# Altium project Flight_Controller.PrjPcb
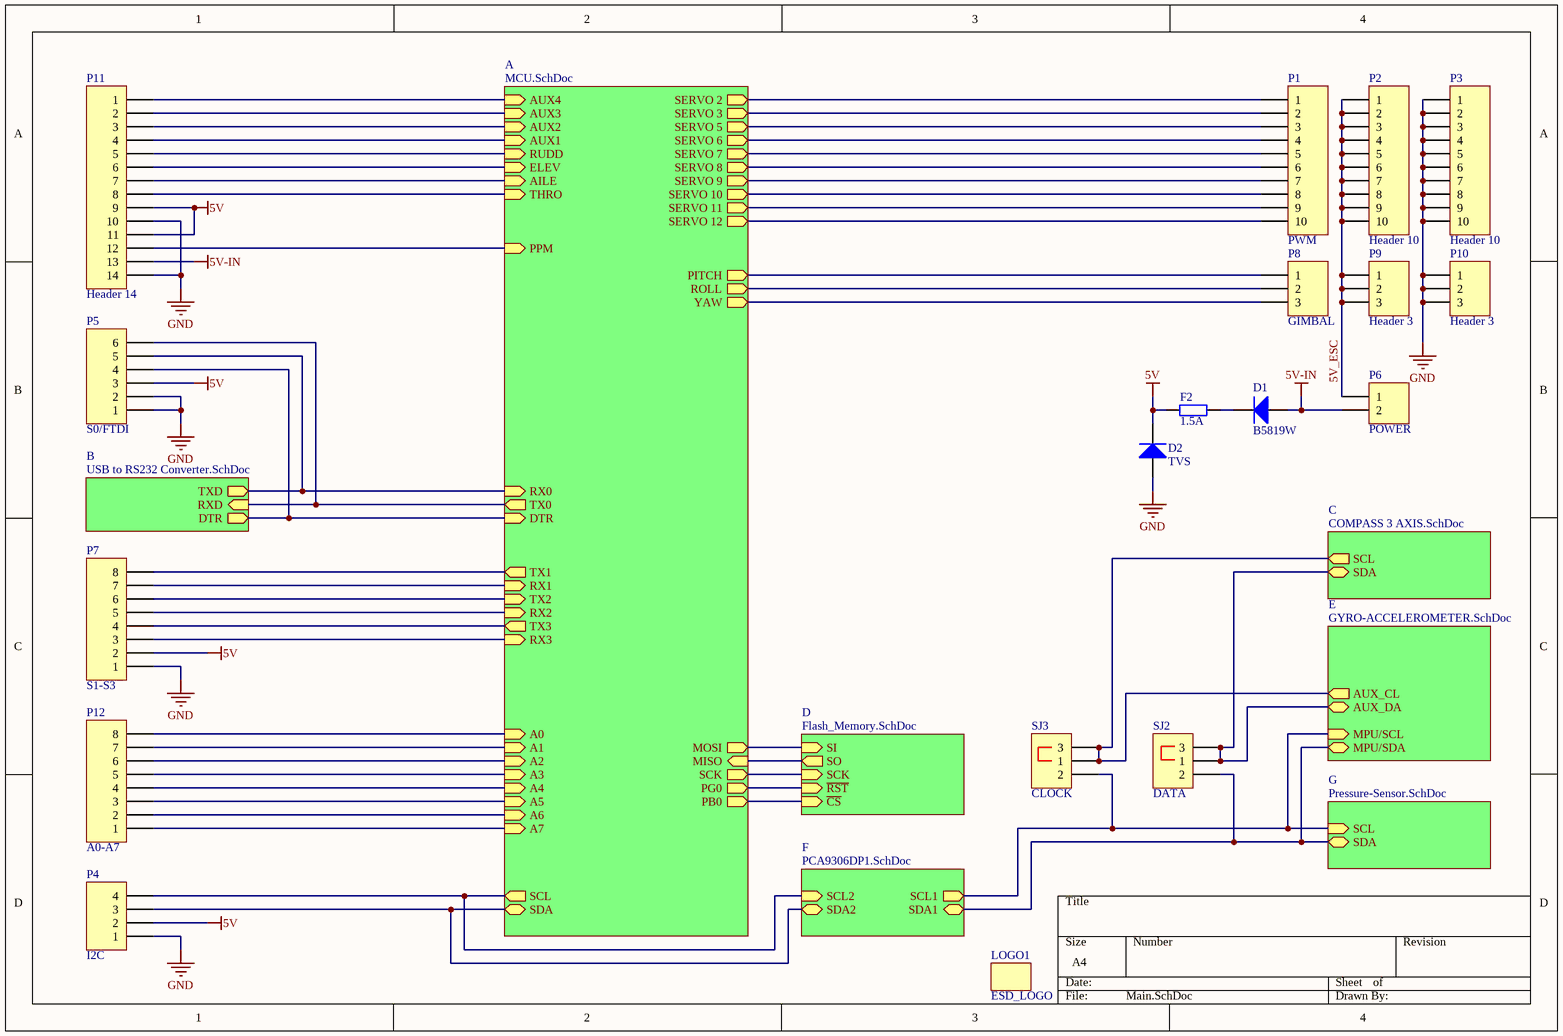
[diagram p0: Main.SchDoc]
8 sheets, 102 parts. Net scope: hierarchical (ports join the sheet entries above them; power ports are global).
Board file: Flight_Controller.PcbDoc
Sheets:
  Main.SchDoc
    A = MCU.SchDoc
    C = COMPASS 3 AXIS.SchDoc
    D = Flash_Memory.SchDoc
    E = GYRO-ACCELEROMETER.SchDoc
    F = PCA9306DP1.SchDoc
    G = Pressure-Sensor.SchDoc
    B = USB to RS232 Converter.SchDoc

## Sheet Main.SchDoc
size A4

### Parts
D1  B5819W  [SOD-123]
D2  TVS  [SOD-123]
F2  1.5A  [FUSE_1206(3216)]
LOGO1  ESD_LOGO  [LOGO_ESD]  (no BOM)
P1  PWM  [Pin Header 1x10 TH Pitch 2.54mm]
P2  Header 10  [Pin Header 1x10 TH Pitch 2.54mm]
P3  Header 10  [Pin Header 1x10 TH Pitch 2.54mm]
P4  I2C  [MOLEX-CONN-PicoBlade 4POS 1.25MM]
P5  S0/FTDI  [MOLEX-CONN-PicoBlade 6POS 1.25MM]
P6  POWER  [Pin Header S/M 02x1 TH Pitch 2.54mm]
P7  S1-S3  [MOLEX-CONN-PicoBlade 8POS 1.25MM]
P8  GIMBAL  [Pin Header 1x3 TH Pitch 2.54mm]
P9  Header 3  [Pin Header 1x3 TH Pitch 2.54mm]
P10  Header 3  [Pin Header 1x3 TH Pitch 2.54mm]
P11  Header 14  [Pin Header 1x14 TH Pitch 2.54mm]
P12  A0-A7  [MOLEX-CONN-PicoBlade 8POS 1.25MM]
SJ2  DATA  [JUMPER_3]
SJ3  CLOCK  [JUMPER_3]

### Sub-sheets
A = MCU.SchDoc: A5 (in), A4 (in), A7 (in), A2 (in), A0 (in), A3 (in), A6 (in), A1 (in), SERVO 10 (out), SERVO 2 (out), YAW (out), SERVO 6 (out), SERVO 9 (out), SERVO 8 (out), SERVO 5 (out), SERVO 3 (out), PITCH (out), SERVO 7 (out), ROLL (out), SERVO 12 (out), SERVO 11 (out), TX2 (in), RX1 (in), TX1 (out), TX3 (out), RX2 (in), RX3 (in), AILE (in), AUX1 (in), AUX4 (in), RUDD (in), AUX3 (in), THRO (in), AUX2 (in), ELEV (in), RX0 (in), TX0 (out), SCL (out), SDA (bidir), SCK (out), MOSI (out), MISO (in), PG0 (out), PB0 (out), PPM (in), DTR (in)
B = USB to RS232 Converter.SchDoc: TXD (out), RXD (in), DTR (out)
C = COMPASS 3 AXIS.SchDoc: SCL (out), SDA (bidir)
D = Flash_Memory.SchDoc: SO (out), ~{RST} (in), SCK (in), SI (in), ~{CS} (in)
E = GYRO-ACCELEROMETER.SchDoc: MPU/SDA (bidir), MPU/SCL (in), AUX_DA (bidir), AUX_CL (out)
F = PCA9306DP1.SchDoc: SDA1 (bidir), SDA2 (bidir), SCL1 (out), SCL2 (in)
G = Pressure-Sensor.SchDoc: SDA (bidir), SCL (in)

### Nets
5V: D2.1(A) F2.2 P4.2 P5.3 P7.2 P11.9 P11.11
5V-IN: D1.2(K) P6.2 P11.13
GND: D2.2(K) P3.1 P3.2 P3.3 P3.4 P3.5 P3.6 P3.7 P3.8 P3.9 P3.10 P4.1 P5.1 P5.2 P7.1 P10.1 P10.2 P10.3 P11.10 P11.14
5V_ESC: P2.1 P2.2 P2.3 P2.4 P2.5 P2.6 P2.7 P2.8 P2.9 P2.10 P6.1 P9.1 P9.2 P9.3
~{DTR}: P5.4 ; sheet A/DTR, sheet B/DTR
MISO: sheet A/MOSI, sheet D/SI
MOSI: sheet A/MISO, sheet D/SO
RX0: P5.5 ; sheet A/RX0, sheet B/TXD
RX1: P7.7 ; sheet A/RX1
RX2: P7.5 ; sheet A/RX2
RX3: P7.3 ; sheet A/RX3
SCK: sheet A/SCK, sheet D/SCK
TX0: P5.6 ; sheet A/TX0, sheet B/RXD
TX1: P7.8 ; sheet A/TX1
TX2: P7.6 ; sheet A/TX2
TX3: P7.4 ; sheet A/TX3
NetD1_1: D1.1(A) F2.1
NetP1_1: P1.1 ; sheet A/SERVO 2
NetP1_2: P1.2 ; sheet A/SERVO 3
NetP1_3: P1.3 ; sheet A/SERVO 5
NetP1_4: P1.4 ; sheet A/SERVO 6
NetP1_5: P1.5 ; sheet A/SERVO 7
NetP1_6: P1.6 ; sheet A/SERVO 8
NetP1_7: P1.7 ; sheet A/SERVO 9
NetP1_8: P1.8 ; sheet A/SERVO 10
NetP1_9: P1.9 ; sheet A/SERVO 11
NetP1_10: P1.10 ; sheet A/SERVO 12
NetP4_3: P4.3 ; sheet A/SDA, sheet F/SDA2
NetP4_4: P4.4 ; sheet A/SCL, sheet F/SCL2
NetP8_1: P8.1 ; sheet A/PITCH
NetP8_2: P8.2 ; sheet A/ROLL
NetP8_3: P8.3 ; sheet A/YAW
NetP11_1: P11.1 ; sheet A/AUX4
NetP11_2: P11.2 ; sheet A/AUX3
NetP11_3: P11.3 ; sheet A/AUX2
NetP11_4: P11.4 ; sheet A/AUX1
NetP11_5: P11.5 ; sheet A/RUDD
NetP11_6: P11.6 ; sheet A/ELEV
NetP11_7: P11.7 ; sheet A/AILE
NetP11_8: P11.8 ; sheet A/THRO
NetP11_12: P11.12 ; sheet A/PPM
NetP12_1: P12.1 ; sheet A/A7
NetP12_2: P12.2 ; sheet A/A6
NetP12_3: P12.3 ; sheet A/A5
NetP12_4: P12.4 ; sheet A/A4
NetP12_5: P12.5 ; sheet A/A3
NetP12_6: P12.6 ; sheet A/A2
NetP12_7: P12.7 ; sheet A/A1
NetP12_8: P12.8 ; sheet A/A0
NetR31_2: sheet A/PG0, sheet D/~{RST}
NetR32_2: sheet A/PB0, sheet D/~{CS}
NetR37_1: SJ3.2 ; sheet E/MPU/SCL, sheet F/SCL1, sheet G/SCL
NetR38_1: SJ2.2 ; sheet E/MPU/SDA, sheet F/SDA1, sheet G/SDA
NetSJ2_1: SJ2.1 SJ2.3 ; sheet C/SDA, sheet E/AUX_DA
NetSJ3_1: SJ3.1 SJ3.3 ; sheet C/SCL, sheet E/AUX_CL

### Library data of the parts
D1 D2 = Diode: Default Diode; Published: 8-Jun-2000; LatestRevisionDate: 17-Jul-2002; LatestRevisionNote: Re-released for DXP Platform.; PackageVersion: Sep-1996; PackageReference: SMC; Publisher: Altium Limited; PackageDescription: DO-214-AB/SMC; 2 C-Bend Leads; Body 7.9 x 5.9 mm, inc. leads (LxW); Code_JEDEC: DO-214-AB
F2 = Res2: Ferrite Bead
LOGO1 = MECHANIC
P1-P3 = Header 10: Header, 10-Pin; LatestRevisionDate: 17-Jul-2002; LatestRevisionNote: Re-released for DXP Platform.; Publisher: Altium Limited
P4 = Header 4: Header, 4-Pin
P5 = Header 6: Header, 6-Pin
P6 = Header 2: Header, 2-Pin
P7 P12 = Header 8: Header, 8-Pin
P8-P10 SJ2 SJ3 = Header 3: Header, 3-Pin; LatestRevisionDate: 17-Jul-2002; LatestRevisionNote: Re-released for DXP Platform.; Publisher: Altium Limited
P11 = Header 14: Header, 14-Pin; LatestRevisionDate: 17-Jul-2002; LatestRevisionNote: Re-released for DXP Platform.; Publisher: Altium Limited

## Sheet MCU.SchDoc
size A4
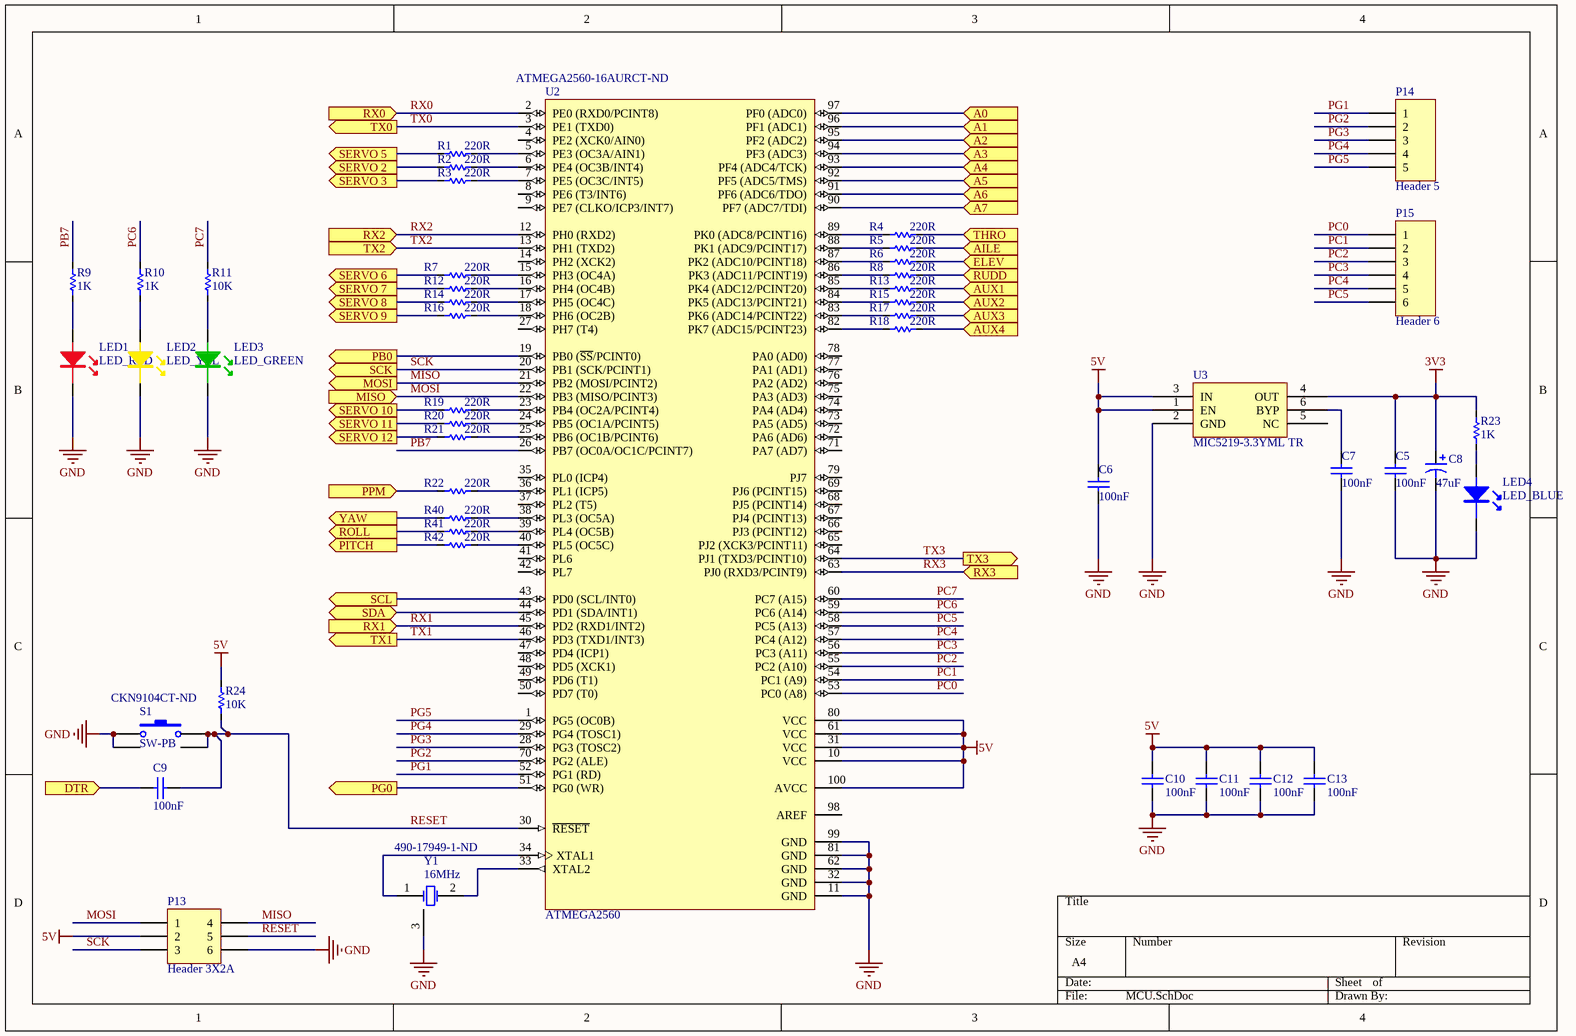
[diagram p1: MCU.SchDoc]

### Parts
C5  100nF  [C0603(1608)]
C6  100nF  [C0603(1608)]
C7  100nF  [C0603(1608)]
C8  47uF  [TANT_C1411(3528)]
C9  100nF  [C0603(1608)]
C10  100nF  [C0603(1608)]
C11  100nF  [C0603(1608)]
C12  100nF  [C0603(1608)]
C13  100nF  [C0603(1608)]
LED1  LED_RED  [L0805_RED]
LED2  LED_YEL  [L0805_YEL]
LED3  LED_GREEN  [L0805_GRE]
LED4  LED_BLUE  [L0603_BLU]
P13  Header 3X2A  [Pin Header 2x3 TH Pitch 2.54mm]
P14  Header 5  [PAD-1x5 2MM]
P15  Header 6  [PAD-1x6 2MM]
R1  220R  [R0603(1608)]
R2  220R  [R0603(1608)]
R3  220R  [R0603(1608)]
R4  220R  [R0603(1608)]
R5  220R  [R0603(1608)]
R6  220R  [R0603(1608)]
R7  220R  [R0603(1608)]
R8  220R  [R0603(1608)]
R9  1K  [R0603(1608)]
R10  1K  [R0603(1608)]
R11  10K  [R0603(1608)]
R12  220R  [R0603(1608)]
R13  220R  [R0603(1608)]
R14  220R  [R0603(1608)]
R15  220R  [R0603(1608)]
R16  220R  [R0603(1608)]
R17  220R  [R0603(1608)]
R18  220R  [R0603(1608)]
R19  220R  [R0603(1608)]
R20  220R  [R0603(1608)]
R21  220R  [R0603(1608)]
R22  220R  [R0603(1608)]
R23  1K  [R0603(1608)]
R24  10K  [R0603(1608)]
R40  220R  [R0603(1608)]
R41  220R  [R0603(1608)]
R42  220R  [R0603(1608)]
S1  SW-PB  Supplier Part Number 1: CKN9104CT-ND  [SWITCH_PTS525SM15]
U2  ATMEGA2560  Supplier Part Number 1: ATMEGA2560-16AURCT-ND  [100A_M]
U3  MIC5219-3.3YML TR  [6-ML]
Y1  16MHz  Supplier Part Number 1: 490-17949-1-ND  [XTAL_RESONATOR_3.2x1.3]

### Ports
A0 (in), A1 (in), A2 (in), A3 (in), A4 (in), A5 (in), A6 (in), A7 (in), AILE (in), AUX1 (in), AUX2 (in), AUX3 (in), AUX4 (in), DTR (in), ELEV (in), MISO (in), MOSI (out), PB0 (out), PG0 (out), PITCH (out), PPM (in), ROLL (out), RUDD (in), RX0 (in), RX1 (in), RX2 (in), RX3 (in), SCK (out), SCL (out), SDA (bidir), SERVO 2 (out), SERVO 3 (out), SERVO 5 (out), SERVO 6 (out), SERVO 7 (out), SERVO 8 (out), SERVO 9 (out), SERVO 10 (out), SERVO 11 (out), SERVO 12 (out), THRO (in), TX0 (out), TX1 (out), TX2 (in), TX3 (out), YAW (out)

### Nets
3V3: C5.2 C8.1 R23.2 U3.4(OUT)
5V: C6.2 C10.2 C11.2 C12.2 C13.2 P13.2 R24.1 U2.10(VCC) U2.31(VCC) U2.61(VCC) U2.80(VCC) U2.100(AVCC) U3.1(EN) U3.3(IN)
GND: C5.1 C6.1 C7.1 C8.2 C10.1 C11.1 C12.1 C13.1 LED1.2(K) LED2.2(K) LED3.2(K) LED4.2(K) P13.6 S1.1 S1.2 U2.11(GND) U2.32(GND) U2.62(GND) U2.81(GND) U2.99(GND) U3.2(GND) Y1.3(GND)
~{DTR}: C9.1 ; port DTR
MISO: P13.4 U2.21(PB2_(MOSI/PCINT2)) ; port MOSI
MOSI: P13.1 U2.22(PB3_(MISO/PCINT3)) ; port MISO
PB7: R9.2 U2.26(PB7_(OC0A/OC1C/PCINT7))
PC0: P15.1 U2.53(PC0_(A8))
PC1: P15.2 U2.54(PC1_(A9))
PC2: P15.3 U2.55(PC2_(A10))
PC3: P15.4 U2.56(PC3_(A11))
PC4: P15.5 U2.57(PC4_(A12))
PC5: P15.6 U2.58(PC5_(A13))
PC6: R10.2 U2.59(PC6_(A14))
PC7: R11.2 U2.60(PC7_(A15))
PG1: P14.1 U2.52(PG1_(RD))
PG2: P14.2 U2.70(PG2_(ALE))
PG3: P14.3 U2.28(PG3_(TOSC2))
PG4: P14.4 U2.29(PG4_(TOSC1))
PG5: P14.5 U2.1(PG5_(OC0B))
RESET: C9.2 P13.5 R24.2 S1.3 S1.4 U2.30(~{RESET})
RX0: U2.2(PE0_(RXD0/PCINT8)) ; port RX0
RX1: U2.45(PD2_(RXD1/INT2)) ; port RX1
RX2: U2.12(PH0_(RXD2)) ; port RX2
RX3: U2.63(PJ0_(RXD3/PCINT9)) ; port RX3
SCK: P13.3 U2.20(PB1_(SCK/PCINT1)) ; port SCK
TX0: U2.3(PE1_(TXD0)) ; port TX0
TX1: U2.46(PD3_(TXD1/INT3)) ; port TX1
TX2: U2.13(PH1_(TXD2)) ; port TX2
TX3: U2.64(PJ1_(TXD3/PCINT10)) ; port TX3
NetC7_2: C7.2 U3.6(BYP)
NetLED1_1: LED1.1(A) R9.1
NetLED2_1: LED2.1(A) R10.1
NetLED3_1: LED3.1(A) R11.1
NetLED4_1: LED4.1(A) R23.1
NetP1_1: R2.1 ; port SERVO 2
NetP1_2: R3.1 ; port SERVO 3
NetP1_3: R1.1 ; port SERVO 5
NetP1_4: R7.1 ; port SERVO 6
NetP1_5: R12.1 ; port SERVO 7
NetP1_6: R14.1 ; port SERVO 8
NetP1_7: R16.1 ; port SERVO 9
NetP1_8: R19.1 ; port SERVO 10
NetP1_9: R20.1 ; port SERVO 11
NetP1_10: R21.1 ; port SERVO 12
NetP4_3: U2.44(PD1_(SDA/INT1)) ; port SDA
NetP4_4: U2.43(PD0_(SCL/INT0)) ; port SCL
NetP8_1: R42.1 ; port PITCH
NetP8_2: R41.1 ; port ROLL
NetP8_3: R40.1 ; port YAW
NetP11_1: R18.2 ; port AUX4
NetP11_2: R17.2 ; port AUX3
NetP11_3: R15.2 ; port AUX2
NetP11_4: R13.2 ; port AUX1
NetP11_5: R8.2 ; port RUDD
NetP11_6: R6.2 ; port ELEV
NetP11_7: R5.2 ; port AILE
NetP11_8: R4.2 ; port THRO
NetP11_12: R22.1 ; port PPM
NetP12_1: U2.90(PF7_(ADC7/TDI)) ; port A7
NetP12_2: U2.91(PF6_(ADC6/TDO)) ; port A6
NetP12_3: U2.92(PF5_(ADC5/TMS)) ; port A5
NetP12_4: U2.93(PF4_(ADC4/TCK)) ; port A4
NetP12_5: U2.94(PF3_(ADC3)) ; port A3
NetP12_6: U2.95(PF2_(ADC2)) ; port A2
NetP12_7: U2.96(PF1_(ADC1)) ; port A1
NetP12_8: U2.97(PF0_(ADC0)) ; port A0
NetR1_2: R1.2 U2.5(PE3_(OC3A/AIN1))
NetR2_2: R2.2 U2.6(PE4_(OC3B/INT4))
NetR3_2: R3.2 U2.7(PE5_(OC3C/INT5))
NetR4_1: R4.1 U2.89(PK0_(ADC8/PCINT16))
NetR5_1: R5.1 U2.88(PK1_(ADC9/PCINT17))
NetR6_1: R6.1 U2.87(PK2_(ADC10/PCINT18))
NetR7_2: R7.2 U2.15(PH3_(OC4A))
NetR8_1: R8.1 U2.86(PK3_(ADC11/PCINT19))
NetR12_2: R12.2 U2.16(PH4_(OC4B))
NetR13_1: R13.1 U2.85(PK4_(ADC12/PCINT20))
NetR14_2: R14.2 U2.17(PH5_(OC4C))
NetR15_1: R15.1 U2.84(PK5_(ADC13/PCINT21))
NetR16_2: R16.2 U2.18(PH6_(OC2B))
NetR17_1: R17.1 U2.83(PK6_(ADC14/PCINT22))
NetR18_1: R18.1 U2.82(PK7_(ADC15/PCINT23))
NetR19_2: R19.2 U2.23(PB4_(OC2A/PCINT4))
NetR20_2: R20.2 U2.24(PB5_(OC1A/PCINT5))
NetR21_2: R21.2 U2.25(PB6_(OC1B/PCINT6))
NetR22_2: R22.2 U2.36(PL1_(ICP5))
NetR31_2: U2.51(PG0_(WR)) ; port PG0
NetR32_2: U2.19(PB0_(~{SS}/PCINT0)) ; port PB0
NetR40_2: R40.2 U2.38(PL3_(OC5A))
NetR41_2: R41.2 U2.39(PL4_(OC5B))
NetR42_2: R42.2 U2.40(PL5_(OC5C))
NetU2_33: U2.33(XTAL2) Y1.2(OSC2)
NetU2_34: U2.34(XTAL1) Y1.1(OSC1)

Not connected (* = marked no-connect by the designer): U2 4(PE2_(XCK0/AIN0)) 8(PE6_(T3/INT6)) 9(PE7_(CLKO/ICP3/INT7)) 14(PH2_(XCK2)) 27(PH7_(T4)) 35(PL0_(ICP4)) 37(PL2_(T5)) 41(PL6) 42(PL7) 47(PD4_(ICP1)) 48(PD5_(XCK1)) 49(PD6_(T1)) 50(PD7_(T0)) 65(PJ2_(XCK3/PCINT11)) 66(PJ3_(PCINT12)) 67(PJ4_(PCINT13)) 68(PJ5_(PCINT14)) 69(PJ6_(PCINT15)) 71(PA7_(AD7)) 72(PA6_(AD6)) 73(PA5_(AD5)) 74(PA4_(AD4)) 75(PA3_(AD3)) 76(PA2_(AD2)) 77(PA1_(AD1)) 78(PA0_(AD0)) 79(PJ7) 98(AREF); U3 5(NC)

### Library data of the parts
C5-C7 C9-C13 = Cap: Capacitor
C8 = Cap Pol1: Tantalum Capacitor
P13 = Header 3X2A: JTAG
P14 = Header 5: Header, 5-Pin; LatestRevisionDate: 17-Jul-2002; LatestRevisionNote: Re-released for DXP Platform.; Publisher: Altium Limited
P15 = Header 6: Header, 6-Pin; LatestRevisionDate: 17-Jul-2002; LatestRevisionNote: Re-released for DXP Platform.; Publisher: Altium Limited
R1-R24 R40-R42 = R: Resistor
S1 = SW-PB: Switch; Manufacturer: ITT C&K; Manufacturer Part Number: PTS525SM15SMTR2LFS; Mechanical Life: 1000000Cycles; Actuator Material: Nylon,Polyamide; Illumination Type: Non-Illuminated; Operating Force: 160gf; Throw Configuration: SPST; Switch Travel: 0.25mm; Switch Function: Off-Mom; Actuator Type: Standard; Supplier 1: Digi-Key; RoHS: Yes; Stock 1: 389377; Pricing 1: 1 = 0.33000, 10 = 0.32000, 25 = 0.30840, 50 = 0.29680, 100 = 0.28540, 250 = 0.26260, 500 = 0.22834, 1000 = 0.19409 (USD); Mount: Surface Mount; Min Operating Temperature: -20°C; Max Operating Temperature: 70°C; Packaging: Cut Tape; Termination: Gull Wing; Lead Free: Lead Free
U2 = IC: IC MCU 8BIT 256KB FLASH 100TQFP; Manufacturer: Atmel; Manufacturer Part Number: ATMEGA2560-16AUR; Core Processor: AVR; Core Size: 8-Bit; Speed: 16MHz; Connectivity: EBI/EMI, I²C, SPI, UART/USART; Peripherals: Brown-out Detect/Reset, POR, PWM, WDT; Number of I/O: 86; Program Memory Size: 256KB (128K x 16); EEPROM Size: 4K x 8; RAM Size: 8K x 8; Voltage - Supply (Vcc/Vdd): 4.5 V ~ 5.5 V; Data Converters: A/D 16x10b; Oscillator Type: Internal; Supplier 1: Digi-Key; RoHS: RoHS Compliant; Category: Integrated Circuits (ICs); Stock 1: 9312; Pricing 1: 1=17.28, 10=15.685, 25=14.5428, 100=13.3245, 250=12.1824, 500=11.34486 (USD); Packaging: Cut Tape (CT); Program Memory Type: FLASH; Operating Temperature: -40°C ~ 85°C; Package / Case: 100-TQFP; Supplier Device Package: 100-TQFP (14x14); ComponentLink1URL: http://www.atmel.com/Images/Atmel-2549-8-bit-AVR-Microcontroller-ATmega640-1280-1281-2560-2561_Summary.pdf; ComponentLink1Description: http://www.atmel.com/Images/Atmel-2549-8-bit-AVR-Microcontroller-ATmega640-1280-1281-2560-2561_Summary.pdf
U3 = MIC5219-3.3YML: IC REG LDO 3.3V 0.5A 6MLF; Manufacturer: Micrel Inc.; Regulator Topology: Positive Fixed; Current - Output: 500mA; Voltage - Dropout (Typical): 0.35V @ 500mA; Number of Regulators: 1; Voltage - Input: Up to 12V; Supplier 1: Digi-Key; Manufacturer Part Number: MIC5219-3.3YML TR; RoHS: RoHS Compliant; Category: Integrated Circuits (ICs); Stock 1: 10244; Pricing 1: 1=2.74, 10=2.477, 25=2.2188, 100=1.9952, 250=1.7716, 500=1.548, 1000=1.2814, 2500=1.1954 (USD); Packaging: Cut Tape (CT); Voltage - Output: 3.3V; Current - Limit (Min): -; Operating Temperature: -40°C ~ 125°C; Mounting Type: Surface Mount; Package / Case: 6-VQFN Exposed Pad, 6-MLF®; Supplier Device Package: 6-MLF® (2x2); ComponentLink1URL: http://www.micrel.com/_PDF/mic5219.pdf; ComponentLink1Description: http://www.micrel.com/_PDF/mic5219.pdf; Supplier Part Number 1: 576-2768-1-ND
Y1 = XTAL: CER RES 16.0000MHZ 15PF SMD AUTO; Supplier 1: Digi-Key

## Sheet COMPASS 3 AXIS.SchDoc
size A4
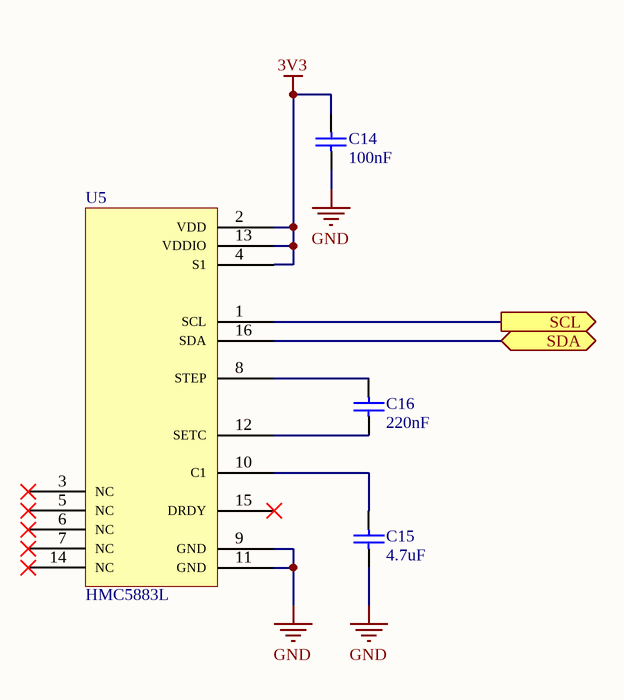
[diagram p2: COMPASS 3 AXIS.SchDoc]

### Parts
C14  100nF  [C0603(1608)]
C15  4.7uF  [C0603(1608)]
C16  220nF  [C0603(1608)]
U5  HMC5883L  [LGA 16 - 3x3]

### Ports
SCL (out), SDA (bidir)

### Nets
3V3: C14.2 U5.2(VDD) U5.4(S1) U5.13(VDDIO)
GND: C14.1 C15.1 U5.9(GND) U5.11(GND)
NetC15_2: C15.2 U5.10(C1)
NetC16_1: C16.1 U5.8(STEP)
NetC16_2: C16.2 U5.12(SETC)
NetSJ2_1: U5.16(SDA) ; port SDA
NetSJ3_1: U5.1(SCL) ; port SCL

Not connected (* = marked no-connect by the designer): U5 3(NC)* 5(NC)* 6(NC)* 7(NC)* 14(NC)* 15(DRDY)*

### Library data of the parts
C14-C16 = Cap: Capacitor
U5 = HMC5883L: IC COMPASS 3 AXIS I2C 16LCC SMD

## Sheet Flash_Memory.SchDoc
size A4
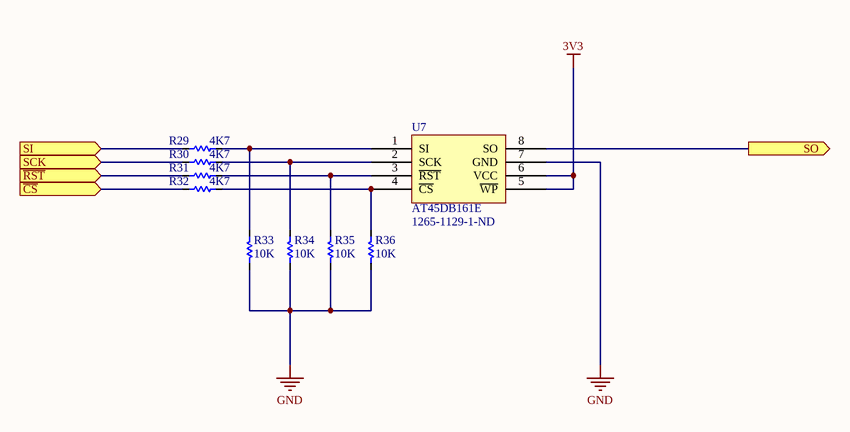
[diagram p3: Flash_Memory.SchDoc]

### Parts
R29  4K7  [R0603(1608)]
R30  4K7  [R0603(1608)]
R31  4K7  [R0603(1608)]
R32  4K7  [R0603(1608)]
R33  10K  [R0603(1608)]
R34  10K  [R0603(1608)]
R35  10K  [R0603(1608)]
R36  10K  [R0603(1608)]
U7  AT45DB161E  Supplier Part Number 1: 1265-1129-1-ND  [8-UDFN 5x6]

### Ports
SCK (in), SI (in), SO (out), ~{CS} (in), ~{RST} (in)

### Nets
3V3: U7.5(~{WP}) U7.6(VCC)
GND: R33.2 R34.2 R35.2 R36.2 U7.7(GND)
MISO: R29.2 ; port SI
MOSI: U7.8(SO) ; port SO
SCK: R30.2 ; port SCK
NetR29_1: R29.1 R33.1 U7.1(SI)
NetR30_1: R30.1 R34.1 U7.2(SCK)
NetR31_1: R31.1 R35.1 U7.3(~{RST})
NetR31_2: R31.2 ; port ~{RST}
NetR32_1: R32.1 R36.1 U7.4(~{CS})
NetR32_2: R32.2 ; port ~{CS}

### Library data of the parts
R29-R36 = R: Resistor
U7 = AT45DB161E: SPI Flash Memory; Manufacturer: Adesto Technologies; Manufacturer Part Number: AT45DB161E-MHD2B-T; Memory Type: DataFLASH; Memory Size: 16M (4096 pages x 512 bytes); Speed: 85MHz; Interface: SPI, RapidS; Voltage - Supply: 2.5 V ~ 3.6 V; Supplier 1: Digi-Key; RoHS: RoHS Compliant; Category: Integrated Circuits (ICs); Stock 1: 6995; Pricing 1: 1=2.67, 10=2.398, 25=2.36, 50=2.353, 100=2.1022, 250=2.03436, 500=2.0263, 1000=1.88715, 2500=1.8561 (USD); Packaging: Cut Tape (CT); Format - Memory: FLASH; Operating Temperature: -40°C ~ 85°C; Package / Case: 8-UDFN Exposed Pad; Supplier Device Package: 8-UDFN (5x6); ComponentLink1URL: http://www.adestotech.com/wp-content/uploads/doc8782.pdf; ComponentLink1Description: http://www.adestotech.com/wp-content/uploads/doc8782.pdf

## Sheet GYRO-ACCELEROMETER.SchDoc
size A4
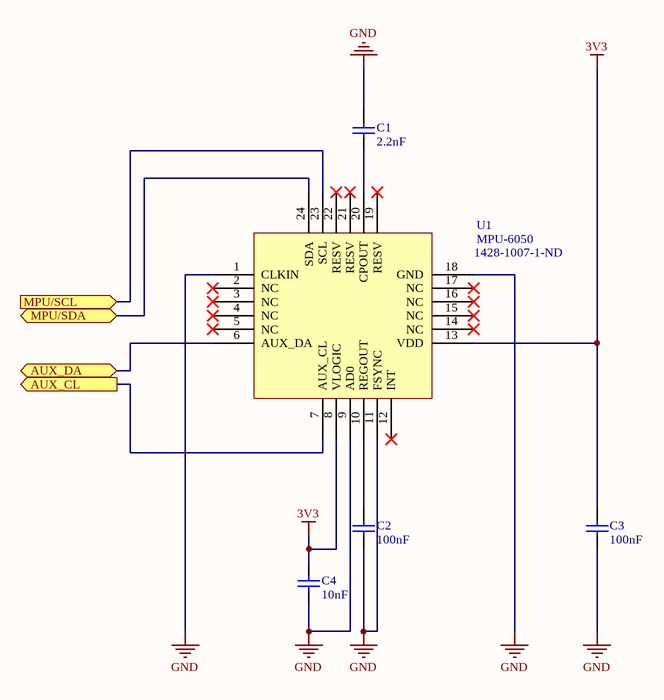
[diagram p4: GYRO-ACCELEROMETER.SchDoc]

### Parts
C1  2.2nF  [C0603(1608)]
C2  100nF  [C0603(1608)]
C3  100nF  [C0603(1608)]
C4  10nF  [C0603(1608)]
U1  MPU-6050  Supplier Part Number 1: 1428-1007-1-ND  [LGA 24]

### Ports
AUX_CL (out), AUX_DA (bidir), MPU/SCL (in), MPU/SDA (bidir)

### Nets
3V3: C3.2 C4.2 U1.8(VLOGIC) U1.13(VDD)
GND: C1.1 C2.1 C3.1 C4.1 U1.1(CLKIN) U1.9(AD0) U1.11(FSYNC) U1.18(GND)
NetC1_2: C1.2 U1.20(CPOUT)
NetC2_2: C2.2 U1.10(REGOUT)
NetR37_1: U1.23(SCL) ; port MPU/SCL
NetR38_1: U1.24(SDA) ; port MPU/SDA
NetSJ2_1: U1.6(AUX_DA) ; port AUX_DA
NetSJ3_1: U1.7(AUX_CL) ; port AUX_CL

Not connected (* = marked no-connect by the designer): U1 2(NC)* 3(NC)* 4(NC)* 5(NC)* 12(INT)* 14(NC)* 15(NC)* 16(NC)* 17(NC)* 19(RESV)* 21(RESV)* 22(RESV)*

### Library data of the parts
C1-C4 = Cap: Capacitor
U1 = MPU-9150: IMU ACCEL/GYRO 3-AXIS I2C 24QFN; Manufacturer: TDK InvenSense; Description: INVENSENSE - MPU-6050 - GYRO / ACCEL, 6-AXIS, I2C, QFN-24; Min Supply Voltage: 2.5V; Max Supply Voltage: 3.6V; Output Type: Digital; Sensitivity: 16384LSB/g; Supplier 1: Digi-Key; Manufacturer Part Number: MPU-6050; RoHS: Yes; Stock 1: 12300; Pricing 1: 1 = 8.310000, 5 = 7.288000, 10 = 6.559000, 25 = 5.830000, 50 = 5.392800, 100 = 4.664000, 500 = 4.372500, 1000 = 4.081000 (USD); Mount: Surface Mount; Case/Package: QFN; Number of Pins: 24; Min Operating Temperature: -40°C; Max Operating Temperature: 85°C; Package Quantity: 5000; Interface: I2C; Packaging: Cut Tape; Length: 4.1mm; Height: 0.9mm; Width: 4.1mm; REACH SVHC: No SVHC; ComponentLink1URL: http://www.farnell.com/datasheets/1788002.pdf?src-supplier=Element14; ComponentLink1Description: http://www.farnell.com/datasheets/1788002.pdf?src-supplier=Element14

## Sheet PCA9306DP1.SchDoc
size A4
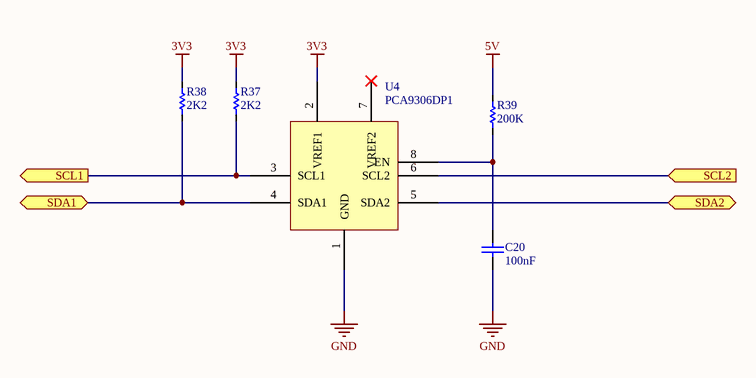
[diagram p5: PCA9306DP1.SchDoc]

### Parts
C20  100nF  [C0603(1608)]
R37  2K2  [R0603(1608)]
R38  2K2  [R0603(1608)]
R39  200K  [R0603(1608)]
U4  PCA9306DP1  [8-TSSOP]

### Ports
SCL1 (out), SCL2 (in), SDA1 (bidir), SDA2 (bidir)

### Nets
3V3: R37.2 R38.2 U4.2(VREF1)
5V: R39.2
GND: C20.1 U4.1(GND)
NetC20_2: C20.2 R39.1 U4.8(EN)
NetP4_3: U4.5(SDA2) ; port SDA2
NetP4_4: U4.6(SCL2) ; port SCL2
NetR37_1: R37.1 U4.3(SCL1) ; port SCL1
NetR38_1: R38.1 U4.4(SDA1) ; port SDA1

Not connected (* = marked no-connect by the designer): U4 7(VREF2)*

### Library data of the parts
C20 = Cap: Capacitor
R37-R39 = R: Resistor
U4 = PCA9306DP1: Dual bidirectional I2C-bus and SMBus voltage-level translator; Manufacturer: NXP Semiconductors; Manufacturer Part Number: PCA9306DP1,125; Translator Type: Voltage Level; Number of Circuits: 1; Channels per Circuit: 2; Voltage - VCCA: 1 V ~ 3.6 V; Voltage - VCCB: 1.8 V ~ 5.5 V; Output Type: Open Drain; Supplier 1: Digi-Key; RoHS: RoHS Compliant; Category: Integrated Circuits (ICs); Stock 1: 21322; Pricing 1: 1=0.74, 10=0.646, 100=0.494, 500=0.3914, 1000=0.3135 (USD); Packaging: Cut Tape (CT); Channel Type: Bidirectional; Input Signal: -; Output Signal: -; Data Rate: -; Operating Temperature: -40°C ~ 85°C (TA); Features: Auto-Direction Sensing; Mounting Type: Surface Mount; Package / Case: 8-TSSOP, 8-MSOP (0.118", 3.00mm Width); Supplier Device Package: 8-TSSOP; ComponentLink1URL: http://www.nxp.com/documents/data_sheet/PCA9306.pdf; ComponentLink1Description: http://www.nxp.com/documents/data_sheet/PCA9306.pdf; Supplier Part Number 1: 568-4243-1-ND

## Sheet Pressure-Sensor.SchDoc
size A4
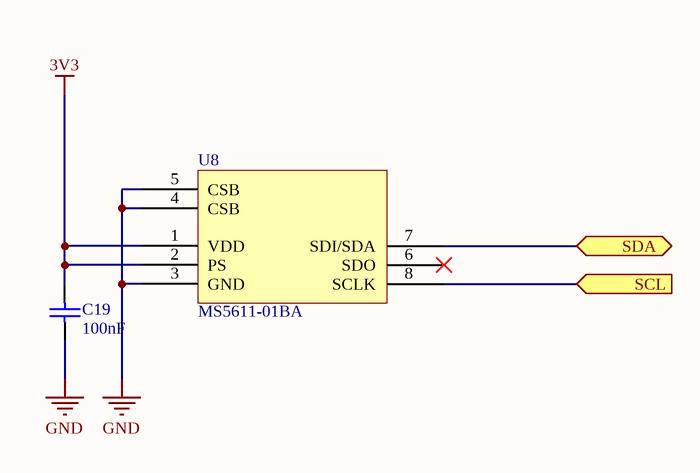
[diagram p6: Pressure-Sensor.SchDoc]

### Parts
C19  100nF  [C0603(1608)]
U8  MS5611-01BA  [MS5611-01BA01]

### Ports
SCL (in), SDA (bidir)

### Nets
3V3: C19.2 U8.1(VDD) U8.2(PS)
GND: C19.1 U8.3(GND) U8.4(CSB) U8.5(CSB)
NetR37_1: U8.8(SCLK) ; port SCL
NetR38_1: U8.7(SDI/SDA) ; port SDA

Not connected (* = marked no-connect by the designer): U8 6(SDO)*

### Library data of the parts
C19 = Cap: Capacitor
U8 = SENSOR: Barometric Pressure Sensor

## Sheet USB to RS232 Converter.SchDoc
size A4
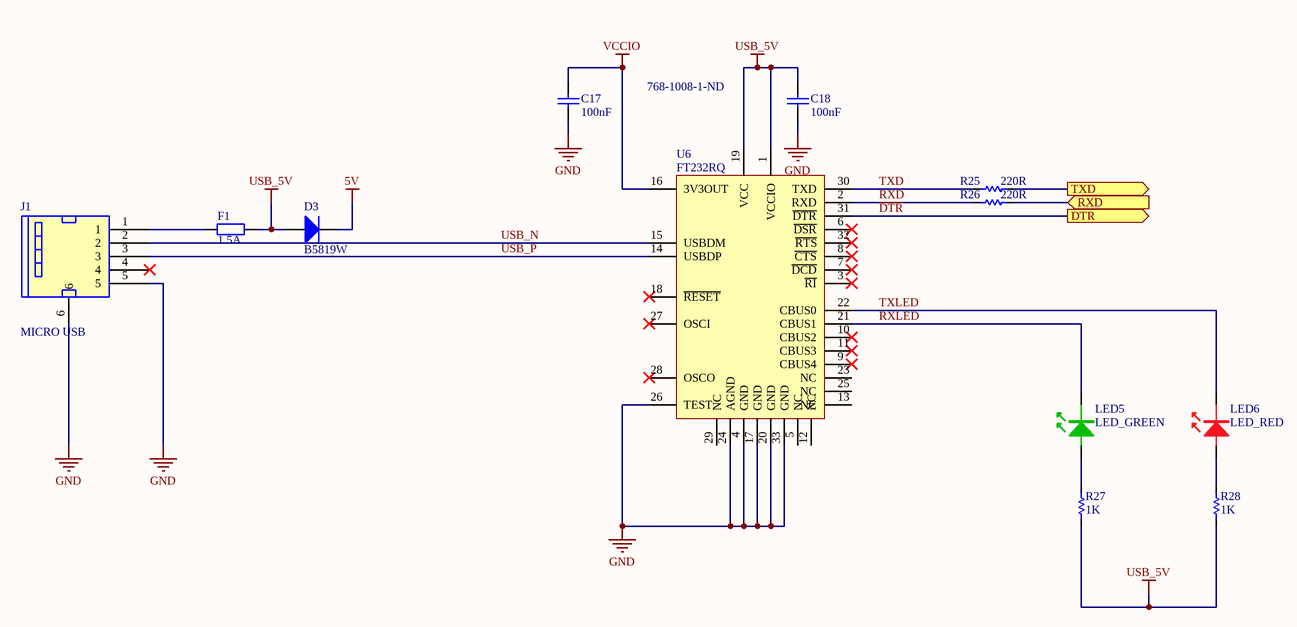
[diagram p7: USB to RS232 Converter.SchDoc]

### Parts
C17  100nF  [C0603(1608)]
C18  100nF  [C0603(1608)]
D3  B5819W  [SOD-123]
F1  1.5A  [FUSE_1206(3216)]
J1  MICRO USB  [MICRO_USB]
LED5  LED_GREEN  [L0603_GRE]
LED6  LED_RED  [L0603_RED]
R25  220R  [R0603(1608)]
R26  220R  [R0603(1608)]
R27  1K  [R0603(1608)]
R28  1K  [R0603(1608)]
U6  FT232RQ  Supplier Part Number 1: 768-1008-1-ND  [QFN-32]

### Ports
DTR (out), RXD (in), TXD (out)

### Nets
5V: D3.1(A)
GND: C17.1 C18.1 J1.5 J1.6 U6.4(GND) U6.17(GND) U6.20(GND) U6.24(AGND) U6.26(TEST) U6.33(GND)
USB_5V: C18.2 D3.2(K) F1.2 R27.2 R28.2 U6.1(VCCIO) U6.19(VCC)
VCCIO: C17.2 U6.16(3V3OUT)
~{DTR}: U6.31(~{DTR}) ; port DTR
RX0: R25.2 ; port TXD
RXD: R26.1 U6.2(RXD)
RXLED: LED5.2(K) U6.21(CBUS1)
TX0: R26.2 ; port RXD
TXD: R25.1 U6.30(TXD)
TXLED: LED6.2(K) U6.22(CBUS0)
USB_N: J1.2 U6.15(USBDM)
USB_P: J1.3 U6.14(USBDP)
NetF1_1: F1.1 J1.1
NetLED5_1: LED5.1(A) R27.1
NetLED6_1: LED6.1(A) R28.1

Not connected (* = marked no-connect by the designer): J1 4*; U6 3(~{RI})* 5(NC) 6(~{DSR})* 7(~{DCD})* 8(~{CTS})* 9(CBUS4)* 10(CBUS2)* 11(CBUS3)* 12(NC) 13(NC) 18(~{RESET})* 23(NC) 25(NC) 27(OSCI)* 28(OSCO)* 29(NC) 32(~{RTS})*

### Library data of the parts
C17 C18 = Cap: Capacitor
D3 = Diode: Default Diode; Published: 8-Jun-2000; LatestRevisionDate: 17-Jul-2002; LatestRevisionNote: Re-released for DXP Platform.; PackageVersion: Sep-1996; PackageReference: SMC; Publisher: Altium Limited; PackageDescription: DO-214-AB/SMC; 2 C-Bend Leads; Body 7.9 x 5.9 mm, inc. leads (LxW); Code_JEDEC: DO-214-AB
F1 = Res2: Ferrite Bead
J1 = MINI_USB: I/O Connector
R25-R28 = R: Resistor
U6 = IC_FT232RQ: FT232R USB UART; Manufacturer: FTDI, Future Technology Devices International Ltd; Manufacturer Part Number: FT232RQ-REEL; Function: Bridge, USB to UART; Standards: USB 2.0; Voltage - Supply: 3.3 V ~ 5.25 V; Current - Supply: 15mA; Supplier 1: Digi-Key; RoHS: RoHS Compliant; Category: Integrated Circuits (ICs); Stock 1: 15537; Pricing 1: 1=4.5, 10=4.05, 50=3.85, 100=3.65, 250=3.25, 500=3.05 (USD); Packaging: Cut Tape (CT); Protocol: USB; Interface: UART; Operating Temperature: -40°C ~ 85°C; Package / Case: 32-VFQFN Exposed Pad; Supplier Device Package: 32-QFN Exposed Pad (5x5); ComponentLink1URL: http://www.ftdichip.com/Support/Documents/DataSheets/ICs/DS_FT232R.pdf; ComponentLink1Description: http://www.ftdichip.com/Support/Documents/DataSheets/ICs/DS_FT232R.pdf

## Nets that join several sheets
3V3: MCU (C5.2 C8.1 R23.2 U3.4), COMPASS 3 AXIS (C14.2 U5.2 U5.4 U5.13), Flash_Memory (U7.5 U7.6), GYRO-ACCELEROMETER (C3.2 C4.2 U1.8 U1.13), PCA9306DP1 (R37.2 R38.2 U4.2), Pressure-Sensor (C19.2 U8.1 U8.2)
5V: Main (7 pins), MCU (14 pins), PCA9306DP1 (R39.2), USB to RS232 Converter (D3.1)
GND: Main (20 pins), MCU (22 pins), COMPASS 3 AXIS (C14.1 C15.1 U5.9 U5.11), Flash_Memory (5 pins), GYRO-ACCELEROMETER (8 pins), PCA9306DP1 (C20.1 U4.1), Pressure-Sensor (C19.1 U8.3 U8.4 U8.5), USB to RS232 Converter (10 pins)
~{DTR}: Main (P5.4), MCU (C9.1), USB to RS232 Converter (U6.31)
MISO: MCU (P13.4 U2.21), Flash_Memory (R29.2)
MOSI: MCU (P13.1 U2.22), Flash_Memory (U7.8)
NetP1_1: Main (P1.1), MCU (R2.1)
NetP1_2: Main (P1.2), MCU (R3.1)
NetP1_3: Main (P1.3), MCU (R1.1)
NetP1_4: Main (P1.4), MCU (R7.1)
NetP1_5: Main (P1.5), MCU (R12.1)
NetP1_6: Main (P1.6), MCU (R14.1)
NetP1_7: Main (P1.7), MCU (R16.1)
NetP1_8: Main (P1.8), MCU (R19.1)
NetP1_9: Main (P1.9), MCU (R20.1)
NetP1_10: Main (P1.10), MCU (R21.1)
NetP4_3: Main (P4.3), MCU (U2.44), PCA9306DP1 (U4.5)
NetP4_4: Main (P4.4), MCU (U2.43), PCA9306DP1 (U4.6)
NetP8_1: Main (P8.1), MCU (R42.1)
NetP8_2: Main (P8.2), MCU (R41.1)
NetP8_3: Main (P8.3), MCU (R40.1)
NetP11_1: Main (P11.1), MCU (R18.2)
NetP11_2: Main (P11.2), MCU (R17.2)
NetP11_3: Main (P11.3), MCU (R15.2)
NetP11_4: Main (P11.4), MCU (R13.2)
NetP11_5: Main (P11.5), MCU (R8.2)
NetP11_6: Main (P11.6), MCU (R6.2)
NetP11_7: Main (P11.7), MCU (R5.2)
NetP11_8: Main (P11.8), MCU (R4.2)
NetP11_12: Main (P11.12), MCU (R22.1)
NetP12_1: Main (P12.1), MCU (U2.90)
NetP12_2: Main (P12.2), MCU (U2.91)
NetP12_3: Main (P12.3), MCU (U2.92)
NetP12_4: Main (P12.4), MCU (U2.93)
NetP12_5: Main (P12.5), MCU (U2.94)
NetP12_6: Main (P12.6), MCU (U2.95)
NetP12_7: Main (P12.7), MCU (U2.96)
NetP12_8: Main (P12.8), MCU (U2.97)
NetR31_2: MCU (U2.51), Flash_Memory (R31.2)
NetR32_2: MCU (U2.19), Flash_Memory (R32.2)
NetR37_1: Main (SJ3.2), GYRO-ACCELEROMETER (U1.23), PCA9306DP1 (R37.1 U4.3), Pressure-Sensor (U8.8)
NetR38_1: Main (SJ2.2), GYRO-ACCELEROMETER (U1.24), PCA9306DP1 (R38.1 U4.4), Pressure-Sensor (U8.7)
NetSJ2_1: Main (SJ2.1 SJ2.3), COMPASS 3 AXIS (U5.16), GYRO-ACCELEROMETER (U1.6)
NetSJ3_1: Main (SJ3.1 SJ3.3), COMPASS 3 AXIS (U5.1), GYRO-ACCELEROMETER (U1.7)
RX0: Main (P5.5), MCU (U2.2), USB to RS232 Converter (R25.2)
RX1: Main (P7.7), MCU (U2.45)
RX2: Main (P7.5), MCU (U2.12)
RX3: Main (P7.3), MCU (U2.63)
SCK: MCU (P13.3 U2.20), Flash_Memory (R30.2)
TX0: Main (P5.6), MCU (U2.3), USB to RS232 Converter (R26.2)
TX1: Main (P7.8), MCU (U2.46)
TX2: Main (P7.6), MCU (U2.13)
TX3: Main (P7.4), MCU (U2.64)

## Assembly variants
Flight_Controller: not fitted P13 P14 P15 SJ2 SJ3